# EAGLE schematic mewa (EAGLE 9.2.0)
CNAME: Mewa guitar processor; CREVISION: 1.0; DESIGNER: Bartosz Cichocki

## Sheet 1 of 2
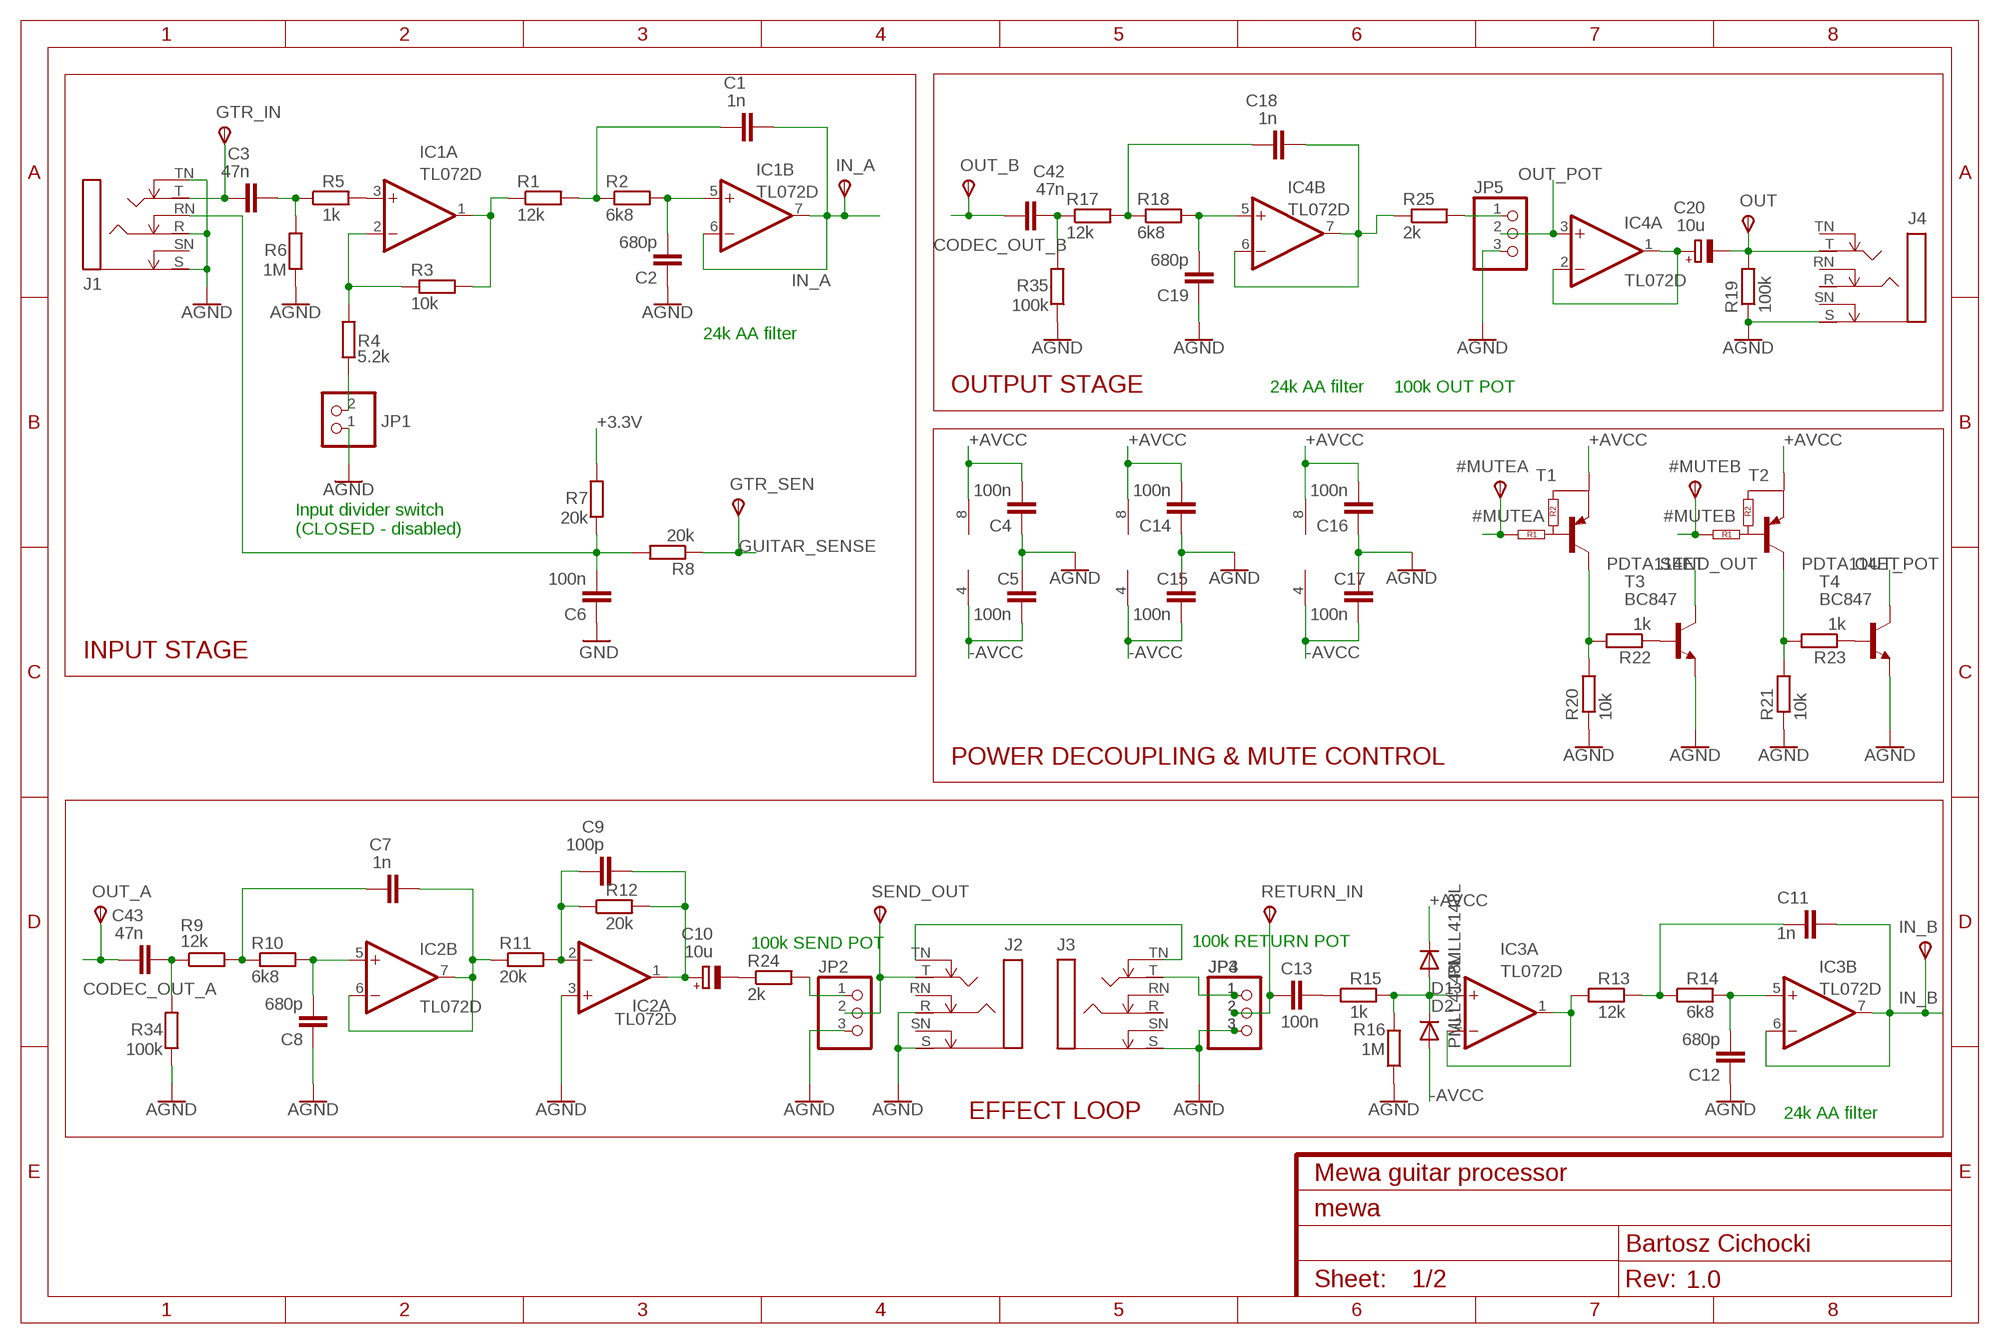
[diagram p0: schematic, sheet 1]

### Parts
#MUTEA  TPSTP20R  [TP20R]
#MUTEB  TPSTP20R  [TP20R]
C1  1n  C-EUC0805  [C0805]
C2  680p  C-EUC0805  [C0805]
C3  47n  C-EUC0805  [C0805]
C4  100n  C-EUC0805  [C0805]
C5  100n  C-EUC0805  [C0805]
C6  100n  C-EUC0805  [C0805]
C7  1n  C-EUC0805  [C0805]
C8  680p  C-EUC0805  [C0805]
C9  100p  C-EUC0805  [C0805]
C10  10u  CPOL-EUE2,5-6E  [E2,5-6E]
C11  1n  C-EUC0805  [C0805]
C12  680p  C-EUC0805  [C0805]
C13  100n  C-EUC0805  [C0805]
C14  100n  C-EUC0805  [C0805]
C15  100n  C-EUC0805  [C0805]
C16  100n  C-EUC0805  [C0805]
C17  100n  C-EUC0805  [C0805]
C18  1n  C-EUC0805  [C0805]
C19  680p  C-EUC0805  [C0805]
C20  10u  CPOL-EUE2,5-6E  [E2,5-6E]
C42  47n  C-EUC0805  [C0805]
C43  47n  C-EUC0805  [C0805]
D1  PMLL4148L  [SOD80C]
D2  PMLL4148L  [SOD80C]
GTR_IN  TPSTP20R  [TP20R]
GTR_SEN  TPSTP20R  [TP20R]
IC1  TL072D  [SO08]
IC2  TL072D  [SO08]
IC3  TL072D  [SO08]
IC4  TL072D  [SO08]
IN_A  TPSTP20R  [TP20R]
IN_B  TPSTP20R  [TP20R]
J1  STEREOSW  [NMJ6HCD2]
J2  STEREOSW  [NMJ6HCD2]
J3  STEREOSW  [NMJ6HCD2]
J4  STEREOSW  [NMJ6HCD2]
JP1  PINHD-1X2  [1X02]
JP2  PINHD-1X3  [1X03]
JP3  PINHD-1X3  [1X03]
JP4  PINHD-1X3  [1X03]
JP5  PINHD-1X3  [1X03]
OUT  TPSTP20R  [TP20R]
OUT_A  TPSTP20R  [TP20R]
OUT_B  TPSTP20R  [TP20R]
R1  12k  R-EU_M0805  [M0805]
R2  6k8  R-EU_M0805  [M0805]
R3  10k  R-EU_M0805  [M0805]
R4  5.2k  R-EU_M0805  [M0805]
R5  1k  R-EU_M0805  [M0805]
R6  1M  R-EU_M0805  [M0805]
R7  20k  R-EU_M0805  [M0805]
R8  20k  R-EU_M0805  [M0805]
R9  12k  R-EU_M0805  [M0805]
R10  6k8  R-EU_M0805  [M0805]
R11  20k  R-EU_M0805  [M0805]
R12  20k  R-EU_M0805  [M0805]
R13  12k  R-EU_M0805  [M0805]
R14  6k8  R-EU_M0805  [M0805]
R15  1k  R-EU_M0805  [M0805]
R16  1M  R-EU_M0805  [M0805]
R17  12k  R-EU_M0805  [M0805]
R18  6k8  R-EU_M0805  [M0805]
R19  100k  R-EU_M0805  [M0805]
R20  10k  R-EU_M0805  [M0805]
R21  10k  R-EU_M0805  [M0805]
R22  1k  R-EU_M0805  [M0805]
R23  1k  R-EU_M0805  [M0805]
R24  2k  R-EU_M0805  [M0805]
R25  2k  R-EU_M0805  [M0805]
R34  100k  R-EU_M0805  [M0805]
R35  100k  R-EU_M0805  [M0805]
RETURN_IN  TPSTP20R  [TP20R]
SEND_OUT  TPSTP20R  [TP20R]
T1  PDTA114ET  [SOT23]
T2  PDTA114ET  [SOT23]
T3  BC847  [SOT23]
T4  BC847  [SOT23]

### Nets
#MUTEA: #MUTEA.TP(PP) T1.1(INPUT) ; also sheet 2
#MUTEB: #MUTEB.TP(PP) T2.1(INPUT) ; also sheet 2
+3.3V: R7.2 ; also sheet 2
+AVCC: C4.2 C14.2 C16.2 D1.1(K) IC1.8(P:V+) IC2.8(P:V+) IC3.8(P:V+) T1.2(E) T2.2(E) ; also sheet 2
-AVCC: C5.2 C15.2 C17.2 D2.2(A) IC1.4(P:V-) IC2.4(P:V-) IC3.4(P:V-) ; also sheet 2
AGND: C2.1 C4.1 C5.1 C8.1 C12.1 C14.1 C15.1 C16.1 C17.1 C19.1 IC2.3(A:+IN) J1.R J1.S J1.TN J2.R J2.S J3.S J4.S JP1.1 JP2.3 JP3.3 JP4.3 JP5.3 R6.1 R16.1 R19.1 R20.1 R21.1 R34.1 R35.1 T3.2(E) T4.2(E) ; also sheet 2
CODEC_OUT_A: C43.1 OUT_A.TP(PP) ; also sheet 2
CODEC_OUT_B: C42.1 OUT_B.TP(PP) ; also sheet 2
GND: C6.1 ; also sheet 2
GUITAR_SENSE: GTR_SEN.TP(PP) R8.1
IN_A: C1.2 IC1.6(B:-IN) IC1.7(B:OUT) IN_A.TP(PP) ; also sheet 2
IN_B: C11.2 IC3.6(B:-IN) IC3.7(B:OUT) IN_B.TP(PP) ; also sheet 2
N$1: C1.1 R1.2 R2.1
N$2: IC1.1(A:OUT) R1.1 R3.2
N$3: C2.2 IC1.5(B:+IN) R2.2
N$4: C6.2 J1.RN R7.1 R8.2
N$5: IC1.2(A:-IN) R3.1 R4.2
N$6: JP1.2 R4.1
N$7: IC1.3(A:+IN) R5.2
N$8: C3.2 R5.1 R6.2
N$9: C3.1 GTR_IN.TP(PP) J1.T
N$10: C7.1 R9.2 R10.1
N$11: C8.2 IC2.5(B:+IN) R10.2
N$12: C9.1 IC2.2(A:-IN) R11.2 R12.1
N$13: C9.2 C10.+ IC2.1(A:OUT) R12.2
N$14: JP2.1 R24.2
N$15: J3.T JP3.1 JP4.1
N$16: C10.- R24.1
N$17: C11.1 R13.2 R14.1
N$18: J2.TN J3.TN
N$19: C12.2 IC3.5(B:+IN) R14.2
N$20: IC3.1(A:OUT) IC3.2(A:-IN) R13.1
N$21: C13.1 R15.1
N$22: D1.2(A) D2.1(K) IC3.3(A:+IN) R15.2 R16.2
N$23: C13.2 JP3.2 JP4.2 RETURN_IN.TP(PP)
N$24: C18.1 R17.2 R18.1
N$25: C19.2 IC4.5(B:+IN) R18.2
N$26: C20.- J4.T OUT.TP(PP) R19.2
N$29: C20.+ IC4.1(A:OUT) IC4.2(A:-IN)
N$31: R20.2 R22.2 T1.3(C)
N$32: R21.2 R23.2 T2.3(C)
N$33: JP5.1 R25.2
N$34: C42.2 R17.1 R35.2
N$35: R22.1 T3.1(B)
N$36: R23.1 T4.1(B)
N$37: C43.2 R9.1 R34.2
OUT_POT: IC4.3(A:+IN) JP5.2 T4.3(C)
SEND_OUT: J2.T JP2.2 SEND_OUT.TP(PP) T3.3(C)
T: C7.2 IC2.6(B:-IN) IC2.7(B:OUT) R11.1
TT: C18.2 IC4.6(B:-IN) IC4.7(B:OUT) R25.1
Unconnected: J1.SN J2.RN J2.SN J3.R J3.RN J3.SN J4.R J4.RN J4.SN J4.TN

### Notes on the sheet
- 24k AA filter
- OUTPUT STAGE | 24k AA filter | 100k OUT POT
- Input divider switch
  (CLOSED - disabled)
- INPUT STAGE
- POWER DECOUPLING & MUTE CONTROL
- 100k SEND POT | 100k RETURN POT
- EFFECT LOOP | 24k AA filter

## Sheet 2 of 2
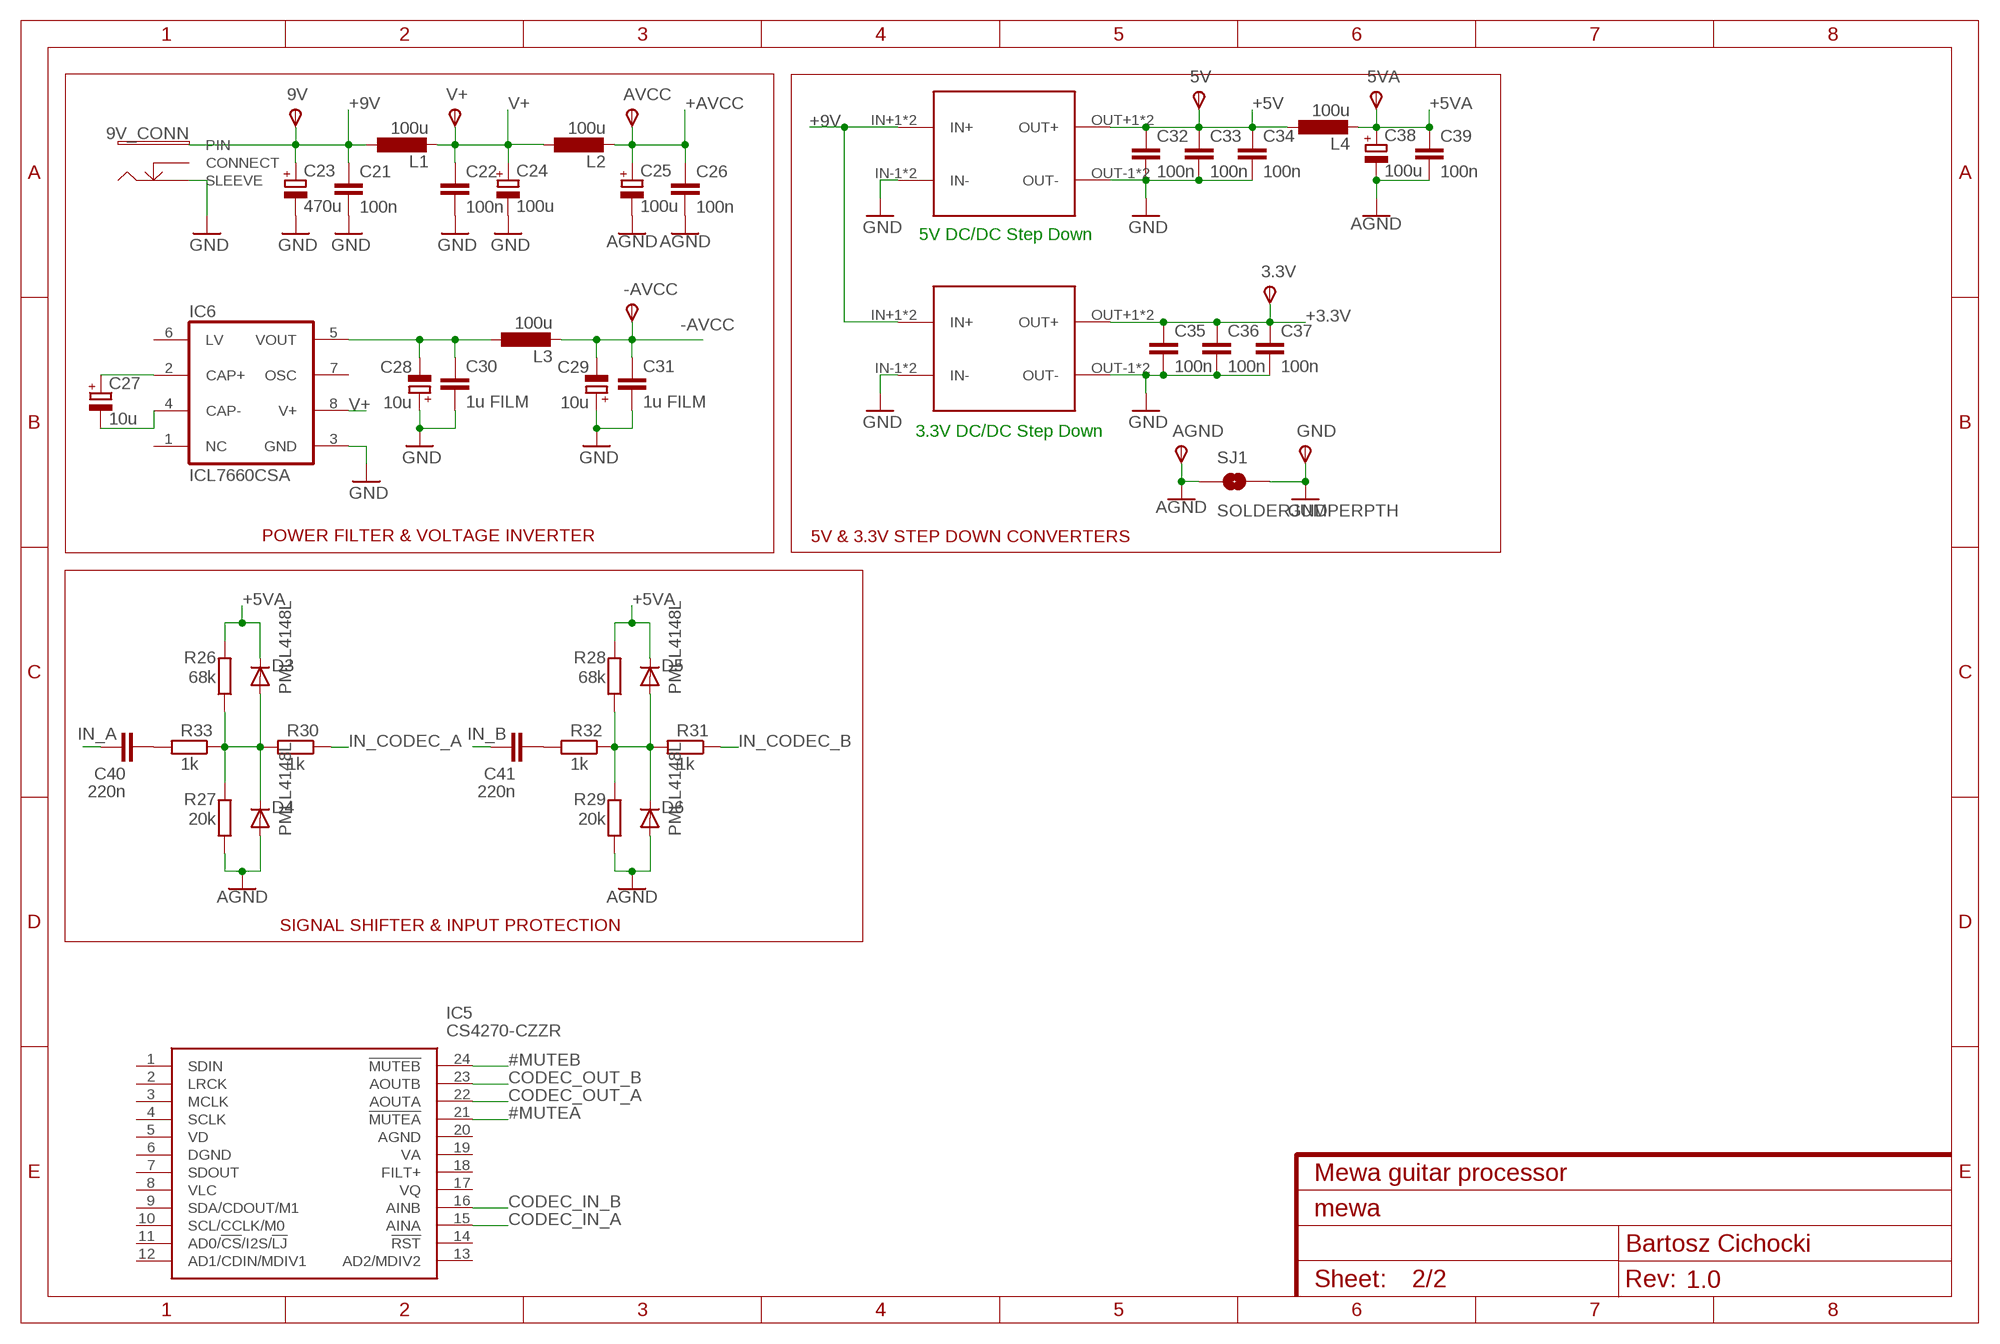
[diagram p1: schematic, sheet 2]

### Parts
3.3V  TPSTP20R  [TP20R]
3V3CONV  DC/DC_MODULE  [DC/DC]
5V  TPSTP20R  [TP20R]
5VA  TPSTP20R  [TP20R]
5VCONV  DC/DC_MODULE  [DC/DC]
9V  TPSTP20R  [TP20R]
9V_CONN  DCBOSS  [BOSS_JACK]
-AVCC  TPSTP20R  [TP20R]
AGND  TPSTP20R  [TP20R]
AVCC  TPSTP20R  [TP20R]
C21  100n  C-EUC0805  [C0805]
C22  100n  C-EUC0805  [C0805]
C23  470u  CPOL-EUE2.5-7  [E2,5-7]
C24  100u  CPOL-EUE2.5-7  [E2,5-7]
C25  100u  CPOL-EUE2.5-7  [E2,5-7]
C26  100n  C-EUC0805  [C0805]
C27  10u  CPOL-EUE2.5-7  [E2,5-7]
C28  10u  CPOL-EUE2,5-6E  [E2,5-6E]
C29  10u  CPOL-EUE2,5-6E  [E2,5-6E]
C30  1u FILM  C-EUC0805  [C0805]
C31  1u FILM  C-EUC0805  [C0805]
C32  100n  C-EUC0805  [C0805]
C33  100n  C-EUC0805  [C0805]
C34  100n  C-EUC0805  [C0805]
C35  100n  C-EUC0805  [C0805]
C36  100n  C-EUC0805  [C0805]
C37  100n  C-EUC0805  [C0805]
C38  100u  CPOL-EUE2.5-7  [E2,5-7]
C39  100n  C-EUC0805  [C0805]
C40  220n  C-EUC0805  [C0805]
C41  220n  C-EUC0805  [C0805]
D3  PMLL4148L  [SOD80C]
D4  PMLL4148L  [SOD80C]
D5  PMLL4148L  [SOD80C]
D6  PMLL4148L  [SOD80C]
GND  TPSTP20R  [TP20R]
IC5  CS4270-CZZR  [SOP65P640X120-24N]
IC6  ICL7660CSA  [SO08]
L1  100u  L-EU0207/10  [0207/10]
L2  100u  L-EU0207/10  [0207/10]
L3  100u  L-EU0207/10  [0207/10]
L4  100u  L-EU0207/10  [0207/10]
R26  68k  R-EU_M0805  [M0805]
R27  20k  R-EU_M0805  [M0805]
R28  68k  R-EU_M0805  [M0805]
R29  20k  R-EU_M0805  [M0805]
R30  1k  R-EU_M0805  [M0805]
R31  1k  R-EU_M0805  [M0805]
R32  1k  R-EU_M0805  [M0805]
R33  1k  R-EU_M0805  [M0805]
SJ1  SOLDERJUMPERPTH  [SJ_2S-PTH]
V+  TPSTP20R  [TP20R]

### Nets
#MUTEA: IC5.21(!MUTEA) ; also sheet 1
#MUTEB: IC5.24(!MUTEB) ; also sheet 1
+3.3V: 3.3V.TP(PP) 3V3CONV.OUT+1(OUT+) 3V3CONV.OUT+2(OUT+) C35.1 C36.1 C37.1 ; also sheet 1
+5V: 5V.TP(PP) 5VCONV.OUT+1(OUT+) 5VCONV.OUT+2(OUT+) C32.1 C33.1 C34.1 L4.1
+5VA: 5VA.TP(PP) C38.+ C39.1 D3.1(K) D5.1(K) L4.2 R26.2 R28.2
+9V: 3V3CONV.IN+1(IN+) 3V3CONV.IN+2(IN+) 5VCONV.IN+1(IN+) 5VCONV.IN+2(IN+) 9V.TP(PP) 9V_CONN.PIN C21.1 C23.+ L1.1
+AVCC: AVCC.TP(PP) C25.+ C26.1 L2.2 ; also sheet 1
-AVCC: -AVCC.TP(PP) C29.- C31.1 L3.2 ; also sheet 1
AGND: AGND.TP(PP) C25.- C26.2 C38.- C39.2 D4.2(A) D6.2(A) R27.1 R29.1 SJ1.1 ; also sheet 1
CODEC_IN_A: IC5.15(AINA)
CODEC_IN_B: IC5.16(AINB)
CODEC_OUT_A: IC5.22(AOUTA) ; also sheet 1
CODEC_OUT_B: IC5.23(AOUTB) ; also sheet 1
GND: 3V3CONV.IN-1(IN-) 3V3CONV.IN-2(IN-) 3V3CONV.OUT-1(OUT-) 3V3CONV.OUT-2(OUT-) 5VCONV.IN-1(IN-) 5VCONV.IN-2(IN-) 5VCONV.OUT-1(OUT-) 5VCONV.OUT-2(OUT-) 9V_CONN.SLEEVE C21.2 C22.2 C23.- C24.- C28.+ C29.+ C30.2 C31.2 C32.2 C33.2 C34.2 C35.2 C36.2 C37.2 GND.TP(PP) IC6.3(GND) SJ1.2 ; also sheet 1
IN_A: C40.1 ; also sheet 1
IN_B: C41.1 ; also sheet 1
IN_CODEC_A: R30.1
IN_CODEC_B: R31.1
N$27: C27.+ IC6.2(CAP+)
N$28: C27.- IC6.4(CAP-)
N$30: C28.- C30.1 IC6.5(VOUT) L3.1
N$38: D3.2(A) D4.1(K) R26.1 R27.2 R30.2 R33.1
N$39: C41.2 R32.2
N$40: C40.2 R33.2
N$41: D5.2(A) D6.1(K) R28.1 R29.2 R31.2 R32.1
V+: C22.1 C24.+ IC6.8(V+) L1.2 L2.1 V+.TP(PP)
Unconnected: 9V_CONN.CLOSE(CONNECT) IC5.1(SDIN) IC5.2(LRCK) IC5.3(MCLK) IC5.4(SCLK) IC5.5(VD) IC5.6(DGND) IC5.7(SDOUT) IC5.8(VLC) IC5.9(SDA/CDOUT/M1) IC5.10(SCL/CCLK/M0) IC5.11(AD0/!CS!/I2S/!LJ) IC5.12(AD1/CDIN/MDIV1) IC5.13(AD2/MDIV2) IC5.14(!RST) IC5.17(VQ) IC5.18(FILT+) IC5.19(VA) IC5.20(AGND) IC6.1(NC) IC6.6(LV) IC6.7(OSC)

### Notes on the sheet
- 5V DC/DC Step Down
- 3.3V DC/DC Step Down
- POWER FILTER & VOLTAGE INVERTER
- 5V & 3.3V STEP DOWN CONVERTERS
- SIGNAL SHIFTER & INPUT PROTECTION

## Power pins joined to a net without a drawn wire
V+: IC4.8(P:V+)
V-: IC4.4(P:V-)

## Library data of the parts
3.3V 5V 5VA 9V #MUTEA #MUTEB -AVCC AGND AVCC GND GTR_IN GTR_SEN IN_A IN_B OUT OUT_A OUT_B RETURN_IN SEND_OUT V+ = testpad:TPS: TEST PIN
3V3CONV 5VCONV = DEEP_MainBoard — kopia:DC/DC_MODULE: MP1584 3A Step-down module
9V_CONN = gm-jacks:DC: DC Jack
C1-C9 C11-C19 C21 C22 C26 C30-C37 C39-C43 = rcl:C-EU: CAPACITOR, European symbol; SPICEPREFIX: C
C10 C20 C23-C25 C27-C29 C38 = rcl:CPOL-EU: POLARIZED CAPACITOR, European symbol; SPICEPREFIX: C
D1-D6 = NXP_60_26022015:PMLL4148L: Single high-speed switching diodes, fabricated in planar technology, and encapsulated in small hermetically sealed glass SOD80C Surface-Mounted Device (SMD) packages. AAL Eindhoven MK; FARNELL: 1097176
IC1-IC4 = linear:TL072: OP AMP
IC5 = CS4270-CZZR:CS4270-CZZR: Interface - CODECs IC 105dB 192kHz Stereo Codec Source: Datasheet <http://www.mouser.com/ds/2/76/CS4270_F1-39353.pdf>; ARROW_PART_NUMBER: CS4270-CZZR; DESCRIPTION: Interface - CODECs IC 105dB 192kHz Stereo Codec; HEIGHT: 1.2mm; MANUFACTURER_NAME: Cirrus Logic; MANUFACTURER_PART_NUMBER: CS4270-CZZR; MOUSER_PART_NUMBER: 777-CS4270-CZZR; MOUSER_PRICE-STOCK: https://www.mouser.co.uk/ProductDetail/Cirrus-Logic/CS4270-CZZR?qs=bUPhaerQQeGUCIrqegOqfg%3D%3D
IC6 = maxim:ICL7660CSA: VOLTAGE CONVERTER; MF: MAXIM; MPN: ICL7660CSA; OC_FARNELL: 9724710; OC_NEWARK: 34C3732
J1-J4 = gm-jacks:STEREOSW
JP1 = pinhead:PINHD-1X2: PIN HEADER
JP2-JP5 = pinhead:PINHD-1X3: PIN HEADER
L1-L4 = rcl:L-EU: INDUCTOR, European symbol; SPICEPREFIX: L
R1-R35 = rcl:R-EU_: RESISTOR, European symbol; SPICEPREFIX: R
SJ1 = SparkFun-Retired:SOLDERJUMPER: Solder Jumper Standard SMD solder jumper. Used to automate production. Two varients : Normally Open and Normally Closed are the same, but have different paste layers. NC will have a large amount of paste and should jumper during reflow.
T1 T2 = NXP_60_26022015:PDTA114: PNP Resistor-Equipped Transistor (RET) family in small Surface-Mounted Device (SMD) plastic packages. AAL Eindhoven MK
T3 T4 = transistor:BC847: NPN TRANSISTOR